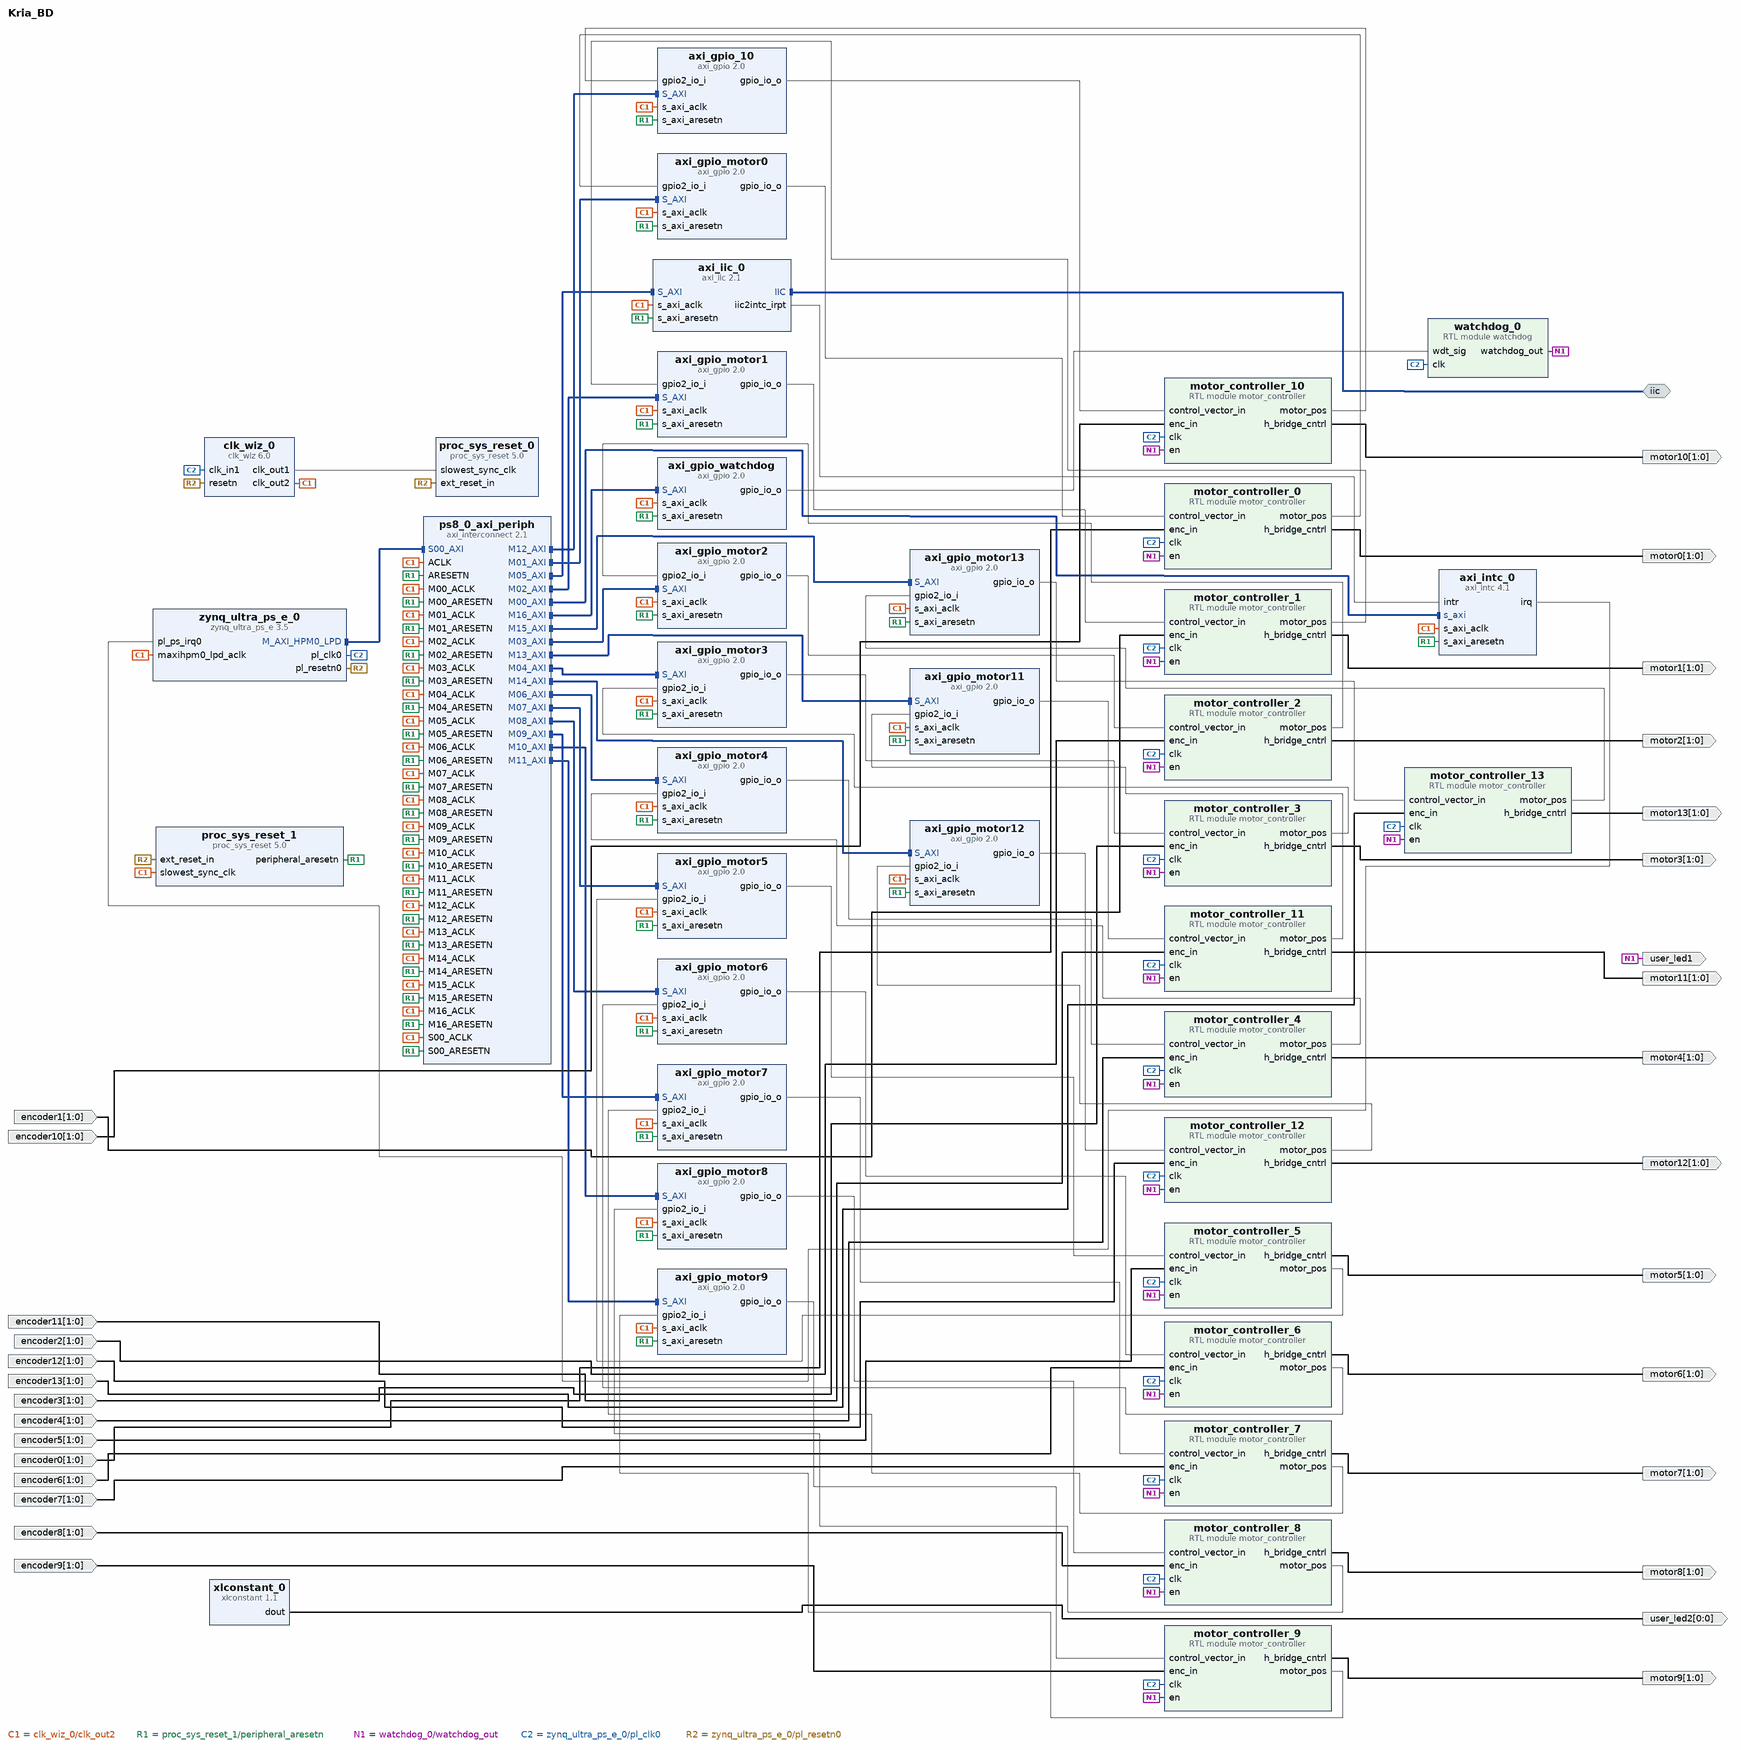
[diagram p0: block diagram of the top level]
# Vivado block design Kria_BD, xck26-sfvc784-2LV-c, Vivado 2023.1
create_bd_design Kria_BD

create_bd_intf_port -mode Master -vlnv xilinx.com:interface:iic_rtl:1.0 iic
create_bd_port -dir O -from 1 -to 0 motor0
create_bd_port -dir I -from 1 -to 0 encoder0
create_bd_port -dir I -from 1 -to 0 encoder1
create_bd_port -dir O -from 1 -to 0 motor1
create_bd_port -dir O -from 1 -to 0 motor2
create_bd_port -dir I -from 1 -to 0 encoder2
create_bd_port -dir O -from 1 -to 0 motor3
create_bd_port -dir I -from 1 -to 0 encoder3
create_bd_port -dir O -from 1 -to 0 motor4
create_bd_port -dir I -from 1 -to 0 encoder4
create_bd_port -dir O -from 1 -to 0 motor5
create_bd_port -dir I -from 1 -to 0 encoder5
create_bd_port -dir O -from 1 -to 0 motor6
create_bd_port -dir I -from 1 -to 0 encoder6
create_bd_port -dir I -from 1 -to 0 encoder7
create_bd_port -dir O -from 1 -to 0 motor7
create_bd_port -dir O -from 1 -to 0 motor8
create_bd_port -dir I -from 1 -to 0 encoder8
create_bd_port -dir O -from 1 -to 0 motor9
create_bd_port -dir I -from 1 -to 0 encoder9
create_bd_port -dir O -from 1 -to 0 motor10
create_bd_port -dir I -from 1 -to 0 encoder10
create_bd_port -dir O -from 1 -to 0 motor11
create_bd_port -dir I -from 1 -to 0 encoder11
create_bd_port -dir O -from 1 -to 0 motor12
create_bd_port -dir I -from 1 -to 0 encoder12
create_bd_port -dir O -from 1 -to 0 motor13
create_bd_port -dir I -from 1 -to 0 encoder13
create_bd_port -dir O user_led1
create_bd_port -dir O -from 0 -to 0 user_led2

create_bd_cell -type ip -vlnv xilinx.com:ip:zynq_ultra_ps_e:3.5 zynq_ultra_ps_e_0
set_property -dict [list \
  CONFIG.PSU_BANK_0_IO_STANDARD LVCMOS18 \
  CONFIG.PSU_BANK_1_IO_STANDARD LVCMOS18 \
  CONFIG.PSU_BANK_2_IO_STANDARD LVCMOS18 \
  CONFIG.PSU_BANK_3_IO_STANDARD LVCMOS18 \
  CONFIG.PSU__CRF_APB__ACPU_CTRL__FREQMHZ 1333.333 \
  CONFIG.PSU__CRF_APB__ACPU_CTRL__SRCSEL APLL \
  CONFIG.PSU__CRF_APB__APLL_CTRL__SRCSEL PSS_REF_CLK \
  CONFIG.PSU__CRF_APB__APLL_FRAC_CFG__ENABLED 1 \
  CONFIG.PSU__CRF_APB__DBG_FPD_CTRL__FREQMHZ 250 \
  CONFIG.PSU__CRF_APB__DBG_FPD_CTRL__SRCSEL IOPLL \
  CONFIG.PSU__CRF_APB__DBG_TRACE_CTRL__FREQMHZ 250 \
  CONFIG.PSU__CRF_APB__DBG_TRACE_CTRL__SRCSEL IOPLL \
  CONFIG.PSU__CRF_APB__DBG_TSTMP_CTRL__FREQMHZ 250 \
  CONFIG.PSU__CRF_APB__DBG_TSTMP_CTRL__SRCSEL IOPLL \
  CONFIG.PSU__CRF_APB__DDR_CTRL__FREQMHZ 1200 \
  CONFIG.PSU__CRF_APB__DDR_CTRL__SRCSEL DPLL \
  CONFIG.PSU__CRF_APB__DPDMA_REF_CTRL__FREQMHZ 600 \
  CONFIG.PSU__CRF_APB__DPDMA_REF_CTRL__SRCSEL APLL \
  CONFIG.PSU__CRF_APB__DPLL_CTRL__SRCSEL PSS_REF_CLK \
  CONFIG.PSU__CRF_APB__DP_AUDIO_REF_CTRL__SRCSEL RPLL \
  CONFIG.PSU__CRF_APB__DP_STC_REF_CTRL__SRCSEL RPLL \
  CONFIG.PSU__CRF_APB__DP_VIDEO_REF_CTRL__SRCSEL VPLL \
  CONFIG.PSU__CRF_APB__GDMA_REF_CTRL__FREQMHZ 600 \
  CONFIG.PSU__CRF_APB__GDMA_REF_CTRL__SRCSEL DPLL \
  CONFIG.PSU__CRF_APB__GPU_REF_CTRL__FREQMHZ 600 \
  CONFIG.PSU__CRF_APB__GPU_REF_CTRL__SRCSEL IOPLL \
  CONFIG.PSU__CRF_APB__TOPSW_LSBUS_CTRL__FREQMHZ 100 \
  CONFIG.PSU__CRF_APB__TOPSW_LSBUS_CTRL__SRCSEL IOPLL \
  CONFIG.PSU__CRF_APB__TOPSW_MAIN_CTRL__FREQMHZ 533.33 \
  CONFIG.PSU__CRF_APB__TOPSW_MAIN_CTRL__SRCSEL DPLL \
  CONFIG.PSU__CRF_APB__VPLL_CTRL__SRCSEL PSS_REF_CLK \
  CONFIG.PSU__CRL_APB__ADMA_REF_CTRL__FREQMHZ 500 \
  CONFIG.PSU__CRL_APB__ADMA_REF_CTRL__SRCSEL IOPLL \
  CONFIG.PSU__CRL_APB__CPU_R5_CTRL__FREQMHZ 533.333 \
  CONFIG.PSU__CRL_APB__CPU_R5_CTRL__SRCSEL RPLL \
  CONFIG.PSU__CRL_APB__DBG_LPD_CTRL__FREQMHZ 250 \
  CONFIG.PSU__CRL_APB__DBG_LPD_CTRL__SRCSEL IOPLL \
  CONFIG.PSU__CRL_APB__IOPLL_CTRL__SRCSEL PSS_REF_CLK \
  CONFIG.PSU__CRL_APB__IOU_SWITCH_CTRL__FREQMHZ 250 \
  CONFIG.PSU__CRL_APB__IOU_SWITCH_CTRL__SRCSEL IOPLL \
  CONFIG.PSU__CRL_APB__LPD_LSBUS_CTRL__FREQMHZ 100 \
  CONFIG.PSU__CRL_APB__LPD_LSBUS_CTRL__SRCSEL IOPLL \
  CONFIG.PSU__CRL_APB__LPD_SWITCH_CTRL__FREQMHZ 500 \
  CONFIG.PSU__CRL_APB__LPD_SWITCH_CTRL__SRCSEL IOPLL \
  CONFIG.PSU__CRL_APB__PCAP_CTRL__FREQMHZ 200 \
  CONFIG.PSU__CRL_APB__PCAP_CTRL__SRCSEL IOPLL \
  CONFIG.PSU__CRL_APB__PL0_REF_CTRL__FREQMHZ 100 \
  CONFIG.PSU__CRL_APB__PL0_REF_CTRL__SRCSEL IOPLL \
  CONFIG.PSU__CRL_APB__PL1_REF_CTRL__SRCSEL IOPLL \
  CONFIG.PSU__CRL_APB__QSPI_REF_CTRL__FREQMHZ 125 \
  CONFIG.PSU__CRL_APB__QSPI_REF_CTRL__SRCSEL IOPLL \
  CONFIG.PSU__CRL_APB__RPLL_CTRL__SRCSEL PSS_REF_CLK \
  CONFIG.PSU__CRL_APB__SPI1_REF_CTRL__SRCSEL IOPLL \
  CONFIG.PSU__CRL_APB__TIMESTAMP_REF_CTRL__FREQMHZ 100 \
  CONFIG.PSU__CRL_APB__TIMESTAMP_REF_CTRL__SRCSEL IOPLL \
  CONFIG.PSU__CSUPMU__PERIPHERAL__VALID 1 \
  CONFIG.PSU__DDRC__BUS_WIDTH {64 Bit} \
  CONFIG.PSU__DDRC__COMPONENTS Components \
  CONFIG.PSU__DDRC__DEVICE_CAPACITY {8192 MBits} \
  CONFIG.PSU__DDRC__DRAM_WIDTH {16 Bits} \
  CONFIG.PSU__DDRC__ECC Disabled \
  CONFIG.PSU__DDRC__MEMORY_TYPE {DDR 4} \
  CONFIG.PSU__DDRC__SPEED_BIN DDR4_2400R \
  CONFIG.PSU__DDR_HIGH_ADDRESS_GUI_ENABLE 1 \
  CONFIG.PSU__DDR__INTERFACE__FREQMHZ 600.000 \
  CONFIG.PSU__DISPLAYPORT__LANE0__ENABLE 0 \
  CONFIG.PSU__DISPLAYPORT__LANE1__ENABLE 0 \
  CONFIG.PSU__DISPLAYPORT__PERIPHERAL__ENABLE 1 \
  CONFIG.PSU__DPAUX__PERIPHERAL__ENABLE 1 \
  CONFIG.PSU__DPAUX__PERIPHERAL__IO {MIO 27 .. 30} \
  CONFIG.PSU__DP__LANE_SEL None \
  CONFIG.PSU__FPGA_PL0_ENABLE 1 \
  CONFIG.PSU__FPGA_PL1_ENABLE 1 \
  CONFIG.PSU__GPIO0_MIO__IO {MIO 0 .. 25} \
  CONFIG.PSU__GPIO0_MIO__PERIPHERAL__ENABLE 1 \
  CONFIG.PSU__GPIO1_MIO__IO {MIO 26 .. 51} \
  CONFIG.PSU__GPIO1_MIO__PERIPHERAL__ENABLE 1 \
  CONFIG.PSU__GT__LINK_SPEED HBR \
  CONFIG.PSU__GT__PRE_EMPH_LVL_4 0 \
  CONFIG.PSU__GT__VLT_SWNG_LVL_4 0 \
  CONFIG.PSU__IOU_SLCR__IOU_TTC_APB_CLK__TTC0_SEL APB \
  CONFIG.PSU__IOU_SLCR__IOU_TTC_APB_CLK__TTC1_SEL APB \
  CONFIG.PSU__IOU_SLCR__IOU_TTC_APB_CLK__TTC2_SEL APB \
  CONFIG.PSU__IOU_SLCR__IOU_TTC_APB_CLK__TTC3_SEL APB \
  CONFIG.PSU__OVERRIDE__BASIC_CLOCK 0 \
  CONFIG.PSU__PMU_COHERENCY 0 \
  CONFIG.PSU__PMU__AIBACK__ENABLE 0 \
  CONFIG.PSU__PMU__EMIO_GPI__ENABLE 0 \
  CONFIG.PSU__PMU__EMIO_GPO__ENABLE 0 \
  CONFIG.PSU__PMU__GPI0__ENABLE 1 \
  CONFIG.PSU__PMU__GPI0__IO {MIO 26} \
  CONFIG.PSU__PMU__GPI1__ENABLE 0 \
  CONFIG.PSU__PMU__GPI2__ENABLE 0 \
  CONFIG.PSU__PMU__GPI3__ENABLE 0 \
  CONFIG.PSU__PMU__GPI4__ENABLE 0 \
  CONFIG.PSU__PMU__GPI5__ENABLE 1 \
  CONFIG.PSU__PMU__GPI5__IO {MIO 31} \
  CONFIG.PSU__PMU__GPO0__ENABLE 0 \
  CONFIG.PSU__PMU__GPO1__ENABLE 0 \
  CONFIG.PSU__PMU__GPO2__ENABLE 0 \
  CONFIG.PSU__PMU__GPO3__ENABLE 1 \
  CONFIG.PSU__PMU__GPO3__IO {MIO 35} \
  CONFIG.PSU__PMU__GPO3__POLARITY low \
  CONFIG.PSU__PMU__GPO4__ENABLE 0 \
  CONFIG.PSU__PMU__GPO5__ENABLE 0 \
  CONFIG.PSU__PMU__PERIPHERAL__ENABLE 1 \
  CONFIG.PSU__PMU__PLERROR__ENABLE 0 \
  CONFIG.PSU__PRESET_APPLIED 1 \
  CONFIG.PSU__PSS_REF_CLK__FREQMHZ 33.333 \
  CONFIG.PSU__QSPI_COHERENCY 0 \
  CONFIG.PSU__QSPI_ROUTE_THROUGH_FPD 0 \
  CONFIG.PSU__QSPI__GRP_FBCLK__ENABLE 0 \
  CONFIG.PSU__QSPI__PERIPHERAL__DATA_MODE x4 \
  CONFIG.PSU__QSPI__PERIPHERAL__ENABLE 1 \
  CONFIG.PSU__QSPI__PERIPHERAL__IO {MIO 0 .. 5} \
  CONFIG.PSU__QSPI__PERIPHERAL__MODE Single \
  CONFIG.PSU__SPI1__GRP_SS0__IO {MIO 9} \
  CONFIG.PSU__SPI1__PERIPHERAL__ENABLE 1 \
  CONFIG.PSU__SPI1__PERIPHERAL__IO {MIO 6 .. 11} \
  CONFIG.PSU__SWDT0__CLOCK__ENABLE 0 \
  CONFIG.PSU__SWDT0__PERIPHERAL__ENABLE 1 \
  CONFIG.PSU__SWDT0__RESET__ENABLE 0 \
  CONFIG.PSU__SWDT1__CLOCK__ENABLE 0 \
  CONFIG.PSU__SWDT1__PERIPHERAL__ENABLE 1 \
  CONFIG.PSU__SWDT1__RESET__ENABLE 0 \
  CONFIG.PSU__TTC0__CLOCK__ENABLE 0 \
  CONFIG.PSU__TTC0__PERIPHERAL__ENABLE 1 \
  CONFIG.PSU__TTC0__WAVEOUT__ENABLE 0 \
  CONFIG.PSU__TTC1__CLOCK__ENABLE 0 \
  CONFIG.PSU__TTC1__PERIPHERAL__ENABLE 1 \
  CONFIG.PSU__TTC1__WAVEOUT__ENABLE 0 \
  CONFIG.PSU__TTC2__CLOCK__ENABLE 0 \
  CONFIG.PSU__TTC2__PERIPHERAL__ENABLE 1 \
  CONFIG.PSU__TTC2__WAVEOUT__ENABLE 0 \
  CONFIG.PSU__TTC3__CLOCK__ENABLE 0 \
  CONFIG.PSU__TTC3__PERIPHERAL__ENABLE 1 \
  CONFIG.PSU__TTC3__WAVEOUT__ENABLE 0 \
  CONFIG.PSU__USE__IRQ0 1 \
  CONFIG.PSU__USE__M_AXI_GP0 0 \
  CONFIG.PSU__USE__M_AXI_GP1 0 \
  CONFIG.PSU__USE__M_AXI_GP2 1 \
] [get_bd_cells zynq_ultra_ps_e_0]
# 259 more settings of zynq_ultra_ps_e_0 are not shown: defaults, MIO pin electricals, DDR timing, and values the tool derives
create_bd_cell -type ip -vlnv xilinx.com:ip:clk_wiz:6.0 clk_wiz_0
set_property -dict [list \
  CONFIG.CLKOUT2_JITTER 102.087 \
  CONFIG.CLKOUT2_PHASE_ERROR 87.181 \
  CONFIG.CLKOUT2_REQUESTED_OUT_FREQ 200.000 \
  CONFIG.CLKOUT2_USED true \
  CONFIG.MMCM_CLKOUT1_DIVIDE 6 \
  CONFIG.NUM_OUT_CLKS 2 \
  CONFIG.RESET_PORT resetn \
  CONFIG.RESET_TYPE ACTIVE_LOW \
  CONFIG.USE_RESET true \
] [get_bd_cells clk_wiz_0]
create_bd_cell -type ip -vlnv xilinx.com:ip:proc_sys_reset:5.0 proc_sys_reset_0
create_bd_cell -type ip -vlnv xilinx.com:ip:proc_sys_reset:5.0 proc_sys_reset_1
create_bd_cell -type ip -vlnv xilinx.com:ip:axi_intc:4.1 axi_intc_0
set_property -dict {CONFIG.C_IRQ_CONNECTION 1} [get_bd_cells axi_intc_0]
create_bd_cell -type ip -vlnv xilinx.com:ip:axi_interconnect:2.1 ps8_0_axi_periph
set_property -dict {CONFIG.NUM_MI 17} [get_bd_cells ps8_0_axi_periph]
create_bd_cell -type ip -vlnv xilinx.com:ip:axi_iic:2.1 axi_iic_0
create_bd_cell -type ip -vlnv xilinx.com:ip:axi_gpio:2.0 axi_gpio_motor0
set_property -dict [list \
  CONFIG.C_ALL_INPUTS_2 1 \
  CONFIG.C_ALL_OUTPUTS 1 \
  CONFIG.C_GPIO2_WIDTH 16 \
  CONFIG.C_GPIO_WIDTH 15 \
  CONFIG.C_IS_DUAL 1 \
] [get_bd_cells axi_gpio_motor0]
create_bd_cell -type ip -vlnv xilinx.com:ip:axi_gpio:2.0 axi_gpio_motor1
set_property -dict [list \
  CONFIG.C_ALL_INPUTS_2 1 \
  CONFIG.C_ALL_OUTPUTS 1 \
  CONFIG.C_GPIO2_WIDTH 16 \
  CONFIG.C_GPIO_WIDTH 15 \
  CONFIG.C_IS_DUAL 1 \
] [get_bd_cells axi_gpio_motor1]
create_bd_cell -type ip -vlnv xilinx.com:ip:axi_gpio:2.0 axi_gpio_motor2
set_property -dict [list \
  CONFIG.C_ALL_INPUTS_2 1 \
  CONFIG.C_ALL_OUTPUTS 1 \
  CONFIG.C_GPIO2_WIDTH 16 \
  CONFIG.C_GPIO_WIDTH 15 \
  CONFIG.C_IS_DUAL 1 \
] [get_bd_cells axi_gpio_motor2]
create_bd_cell -type ip -vlnv xilinx.com:ip:axi_gpio:2.0 axi_gpio_motor3
set_property -dict [list \
  CONFIG.C_ALL_INPUTS_2 1 \
  CONFIG.C_ALL_OUTPUTS 1 \
  CONFIG.C_GPIO2_WIDTH 16 \
  CONFIG.C_GPIO_WIDTH 15 \
  CONFIG.C_IS_DUAL 1 \
] [get_bd_cells axi_gpio_motor3]
create_bd_cell -type ip -vlnv xilinx.com:ip:axi_gpio:2.0 axi_gpio_motor4
set_property -dict [list \
  CONFIG.C_ALL_INPUTS_2 1 \
  CONFIG.C_ALL_OUTPUTS 1 \
  CONFIG.C_GPIO2_WIDTH 16 \
  CONFIG.C_GPIO_WIDTH 15 \
  CONFIG.C_IS_DUAL 1 \
] [get_bd_cells axi_gpio_motor4]
create_bd_cell -type ip -vlnv xilinx.com:ip:axi_gpio:2.0 axi_gpio_motor5
set_property -dict [list \
  CONFIG.C_ALL_INPUTS_2 1 \
  CONFIG.C_ALL_OUTPUTS 1 \
  CONFIG.C_GPIO2_WIDTH 16 \
  CONFIG.C_GPIO_WIDTH 15 \
  CONFIG.C_IS_DUAL 1 \
] [get_bd_cells axi_gpio_motor5]
create_bd_cell -type ip -vlnv xilinx.com:ip:axi_gpio:2.0 axi_gpio_motor6
set_property -dict [list \
  CONFIG.C_ALL_INPUTS_2 1 \
  CONFIG.C_ALL_OUTPUTS 1 \
  CONFIG.C_GPIO2_WIDTH 16 \
  CONFIG.C_GPIO_WIDTH 15 \
  CONFIG.C_IS_DUAL 1 \
] [get_bd_cells axi_gpio_motor6]
create_bd_cell -type ip -vlnv xilinx.com:ip:axi_gpio:2.0 axi_gpio_motor7
set_property -dict [list \
  CONFIG.C_ALL_INPUTS 0 \
  CONFIG.C_ALL_INPUTS_2 1 \
  CONFIG.C_ALL_OUTPUTS 1 \
  CONFIG.C_GPIO2_WIDTH 16 \
  CONFIG.C_GPIO_WIDTH 15 \
  CONFIG.C_IS_DUAL 1 \
] [get_bd_cells axi_gpio_motor7]
create_bd_cell -type ip -vlnv xilinx.com:ip:axi_gpio:2.0 axi_gpio_motor8
set_property -dict [list \
  CONFIG.C_ALL_INPUTS 0 \
  CONFIG.C_ALL_INPUTS_2 1 \
  CONFIG.C_ALL_OUTPUTS 1 \
  CONFIG.C_GPIO2_WIDTH 16 \
  CONFIG.C_GPIO_WIDTH 15 \
  CONFIG.C_IS_DUAL 1 \
] [get_bd_cells axi_gpio_motor8]
create_bd_cell -type ip -vlnv xilinx.com:ip:axi_gpio:2.0 axi_gpio_motor9
set_property -dict [list \
  CONFIG.C_ALL_INPUTS_2 1 \
  CONFIG.C_ALL_OUTPUTS 1 \
  CONFIG.C_GPIO2_WIDTH 16 \
  CONFIG.C_GPIO_WIDTH 15 \
  CONFIG.C_IS_DUAL 1 \
] [get_bd_cells axi_gpio_motor9]
create_bd_cell -type ip -vlnv xilinx.com:ip:axi_gpio:2.0 axi_gpio_10
set_property -dict [list \
  CONFIG.C_ALL_INPUTS 0 \
  CONFIG.C_ALL_INPUTS_2 1 \
  CONFIG.C_ALL_OUTPUTS 1 \
  CONFIG.C_GPIO2_WIDTH 16 \
  CONFIG.C_GPIO_WIDTH 15 \
  CONFIG.C_IS_DUAL 1 \
] [get_bd_cells axi_gpio_10]
create_bd_cell -type ip -vlnv xilinx.com:ip:axi_gpio:2.0 axi_gpio_motor11
set_property -dict [list \
  CONFIG.C_ALL_INPUTS_2 1 \
  CONFIG.C_ALL_OUTPUTS 1 \
  CONFIG.C_GPIO2_WIDTH 16 \
  CONFIG.C_GPIO_WIDTH 15 \
  CONFIG.C_IS_DUAL 1 \
] [get_bd_cells axi_gpio_motor11]
create_bd_cell -type ip -vlnv xilinx.com:ip:axi_gpio:2.0 axi_gpio_motor12
set_property -dict [list \
  CONFIG.C_ALL_INPUTS_2 1 \
  CONFIG.C_ALL_OUTPUTS 1 \
  CONFIG.C_GPIO2_WIDTH 16 \
  CONFIG.C_GPIO_WIDTH 15 \
  CONFIG.C_IS_DUAL 1 \
] [get_bd_cells axi_gpio_motor12]
create_bd_cell -type ip -vlnv xilinx.com:ip:axi_gpio:2.0 axi_gpio_motor13
set_property -dict [list \
  CONFIG.C_ALL_INPUTS_2 1 \
  CONFIG.C_ALL_OUTPUTS 1 \
  CONFIG.C_GPIO2_WIDTH 16 \
  CONFIG.C_GPIO_WIDTH 15 \
  CONFIG.C_IS_DUAL 1 \
] [get_bd_cells axi_gpio_motor13]
create_bd_cell -type ip -vlnv xilinx.com:ip:axi_gpio:2.0 axi_gpio_watchdog
set_property -dict {CONFIG.C_ALL_OUTPUTS 1 CONFIG.C_GPIO_WIDTH 1} [get_bd_cells axi_gpio_watchdog]
create_bd_cell -type module -reference motor_controller motor_controller_0
create_bd_cell -type module -reference motor_controller motor_controller_10
create_bd_cell -type module -reference motor_controller motor_controller_11
create_bd_cell -type module -reference motor_controller motor_controller_12
create_bd_cell -type module -reference motor_controller motor_controller_13
create_bd_cell -type module -reference motor_controller motor_controller_1
create_bd_cell -type module -reference motor_controller motor_controller_2
create_bd_cell -type module -reference motor_controller motor_controller_3
create_bd_cell -type module -reference motor_controller motor_controller_4
create_bd_cell -type module -reference motor_controller motor_controller_5
create_bd_cell -type module -reference motor_controller motor_controller_6
create_bd_cell -type module -reference motor_controller motor_controller_7
create_bd_cell -type module -reference motor_controller motor_controller_8
create_bd_cell -type module -reference motor_controller motor_controller_9
create_bd_cell -type module -reference watchdog watchdog_0
create_bd_cell -type ip -vlnv xilinx.com:ip:xlconstant:1.1 xlconstant_0

# ---- connections ----

connect_bd_intf_net [get_bd_intf_ports iic] [get_bd_intf_pins axi_iic_0/IIC]
connect_bd_intf_net [get_bd_intf_pins ps8_0_axi_periph/M00_AXI] [get_bd_intf_pins axi_intc_0/s_axi]
connect_bd_intf_net [get_bd_intf_pins ps8_0_axi_periph/M01_AXI] [get_bd_intf_pins axi_gpio_motor0/S_AXI]
connect_bd_intf_net [get_bd_intf_pins ps8_0_axi_periph/M02_AXI] [get_bd_intf_pins axi_gpio_motor1/S_AXI]
connect_bd_intf_net [get_bd_intf_pins ps8_0_axi_periph/M03_AXI] [get_bd_intf_pins axi_gpio_motor2/S_AXI]
connect_bd_intf_net [get_bd_intf_pins ps8_0_axi_periph/M04_AXI] [get_bd_intf_pins axi_gpio_motor3/S_AXI]
connect_bd_intf_net [get_bd_intf_pins ps8_0_axi_periph/M05_AXI] [get_bd_intf_pins axi_iic_0/S_AXI]
connect_bd_intf_net [get_bd_intf_pins ps8_0_axi_periph/M06_AXI] [get_bd_intf_pins axi_gpio_motor4/S_AXI]
connect_bd_intf_net [get_bd_intf_pins ps8_0_axi_periph/M07_AXI] [get_bd_intf_pins axi_gpio_motor5/S_AXI]
connect_bd_intf_net [get_bd_intf_pins ps8_0_axi_periph/M08_AXI] [get_bd_intf_pins axi_gpio_motor6/S_AXI]
connect_bd_intf_net [get_bd_intf_pins ps8_0_axi_periph/M09_AXI] [get_bd_intf_pins axi_gpio_motor7/S_AXI]
connect_bd_intf_net [get_bd_intf_pins ps8_0_axi_periph/M10_AXI] [get_bd_intf_pins axi_gpio_motor8/S_AXI]
connect_bd_intf_net [get_bd_intf_pins ps8_0_axi_periph/M11_AXI] [get_bd_intf_pins axi_gpio_motor9/S_AXI]
connect_bd_intf_net [get_bd_intf_pins ps8_0_axi_periph/M12_AXI] [get_bd_intf_pins axi_gpio_10/S_AXI]
connect_bd_intf_net [get_bd_intf_pins ps8_0_axi_periph/M13_AXI] [get_bd_intf_pins axi_gpio_motor11/S_AXI]
connect_bd_intf_net [get_bd_intf_pins ps8_0_axi_periph/M14_AXI] [get_bd_intf_pins axi_gpio_motor12/S_AXI]
connect_bd_intf_net [get_bd_intf_pins ps8_0_axi_periph/M15_AXI] [get_bd_intf_pins axi_gpio_motor13/S_AXI]
connect_bd_intf_net [get_bd_intf_pins ps8_0_axi_periph/M16_AXI] [get_bd_intf_pins axi_gpio_watchdog/S_AXI]
connect_bd_intf_net [get_bd_intf_pins zynq_ultra_ps_e_0/M_AXI_HPM0_LPD] [get_bd_intf_pins ps8_0_axi_periph/S00_AXI]
connect_bd_net -net axi_gpio_0_gpio_io_o [get_bd_pins axi_gpio_motor0/gpio_io_o] [get_bd_pins motor_controller_0/control_vector_in]
connect_bd_net [get_bd_pins axi_gpio_10/gpio_io_o] [get_bd_pins motor_controller_10/control_vector_in]
connect_bd_net -net axi_gpio_11_gpio_io_o [get_bd_pins axi_gpio_motor11/gpio_io_o] [get_bd_pins motor_controller_11/control_vector_in]
connect_bd_net -net axi_gpio_12_gpio_io_o [get_bd_pins axi_gpio_motor12/gpio_io_o] [get_bd_pins motor_controller_12/control_vector_in]
connect_bd_net -net axi_gpio_13_gpio_io_o [get_bd_pins axi_gpio_motor13/gpio_io_o] [get_bd_pins motor_controller_13/control_vector_in]
connect_bd_net -net axi_gpio_1_gpio_io_o [get_bd_pins axi_gpio_motor1/gpio_io_o] [get_bd_pins motor_controller_1/control_vector_in]
connect_bd_net -net axi_gpio_2_gpio_io_o [get_bd_pins axi_gpio_motor2/gpio_io_o] [get_bd_pins motor_controller_2/control_vector_in]
connect_bd_net -net axi_gpio_3_gpio_io_o [get_bd_pins axi_gpio_motor3/gpio_io_o] [get_bd_pins motor_controller_3/control_vector_in]
connect_bd_net -net axi_gpio_4_gpio_io_o [get_bd_pins axi_gpio_motor4/gpio_io_o] [get_bd_pins motor_controller_4/control_vector_in]
connect_bd_net -net axi_gpio_5_gpio_io_o [get_bd_pins axi_gpio_motor5/gpio_io_o] [get_bd_pins motor_controller_5/control_vector_in]
connect_bd_net -net axi_gpio_6_gpio_io_o [get_bd_pins axi_gpio_motor6/gpio_io_o] [get_bd_pins motor_controller_6/control_vector_in]
connect_bd_net -net axi_gpio_7_gpio_io_o [get_bd_pins axi_gpio_motor7/gpio_io_o] [get_bd_pins motor_controller_7/control_vector_in]
connect_bd_net -net axi_gpio_8_gpio_io_o [get_bd_pins axi_gpio_motor8/gpio_io_o] [get_bd_pins motor_controller_8/control_vector_in]
connect_bd_net -net axi_gpio_9_gpio_io_o [get_bd_pins axi_gpio_motor9/gpio_io_o] [get_bd_pins motor_controller_9/control_vector_in]
connect_bd_net [get_bd_pins axi_iic_0/iic2intc_irpt] [get_bd_pins axi_intc_0/intr]
connect_bd_net [get_bd_pins axi_intc_0/irq] [get_bd_pins zynq_ultra_ps_e_0/pl_ps_irq0]
connect_bd_net [get_bd_pins clk_wiz_0/clk_out1] [get_bd_pins proc_sys_reset_0/slowest_sync_clk]
connect_bd_net [get_bd_pins clk_wiz_0/clk_out2] \
  [get_bd_pins proc_sys_reset_1/slowest_sync_clk] [get_bd_pins ps8_0_axi_periph/ACLK] \
  [get_bd_pins zynq_ultra_ps_e_0/maxihpm0_lpd_aclk] [get_bd_pins ps8_0_axi_periph/S00_ACLK] \
  [get_bd_pins axi_intc_0/s_axi_aclk] [get_bd_pins ps8_0_axi_periph/M00_ACLK] [get_bd_pins ps8_0_axi_periph/M01_ACLK] \
  [get_bd_pins ps8_0_axi_periph/M02_ACLK] [get_bd_pins ps8_0_axi_periph/M03_ACLK] [get_bd_pins ps8_0_axi_periph/M04_ACLK] \
  [get_bd_pins axi_iic_0/s_axi_aclk] [get_bd_pins ps8_0_axi_periph/M05_ACLK] [get_bd_pins axi_gpio_motor0/s_axi_aclk] \
  [get_bd_pins axi_gpio_motor1/s_axi_aclk] [get_bd_pins axi_gpio_motor2/s_axi_aclk] [get_bd_pins axi_gpio_motor3/s_axi_aclk] \
  [get_bd_pins axi_gpio_motor4/s_axi_aclk] [get_bd_pins ps8_0_axi_periph/M06_ACLK] [get_bd_pins axi_gpio_motor5/s_axi_aclk] \
  [get_bd_pins ps8_0_axi_periph/M07_ACLK] [get_bd_pins axi_gpio_motor6/s_axi_aclk] [get_bd_pins ps8_0_axi_periph/M08_ACLK] \
  [get_bd_pins axi_gpio_motor7/s_axi_aclk] [get_bd_pins ps8_0_axi_periph/M09_ACLK] [get_bd_pins axi_gpio_motor8/s_axi_aclk] \
  [get_bd_pins ps8_0_axi_periph/M10_ACLK] [get_bd_pins axi_gpio_motor9/s_axi_aclk] [get_bd_pins ps8_0_axi_periph/M11_ACLK] \
  [get_bd_pins axi_gpio_10/s_axi_aclk] [get_bd_pins ps8_0_axi_periph/M12_ACLK] [get_bd_pins axi_gpio_motor11/s_axi_aclk] \
  [get_bd_pins ps8_0_axi_periph/M13_ACLK] [get_bd_pins axi_gpio_motor12/s_axi_aclk] [get_bd_pins ps8_0_axi_periph/M14_ACLK] \
  [get_bd_pins axi_gpio_motor13/s_axi_aclk] [get_bd_pins ps8_0_axi_periph/M15_ACLK] \
  [get_bd_pins axi_gpio_watchdog/s_axi_aclk] [get_bd_pins ps8_0_axi_periph/M16_ACLK]
connect_bd_net -net enc_in_0_1 [get_bd_ports encoder1] [get_bd_pins motor_controller_1/enc_in]
connect_bd_net -net enc_in_10_1 [get_bd_ports encoder11] [get_bd_pins motor_controller_11/enc_in]
connect_bd_net -net enc_in_11_1 [get_bd_ports encoder12] [get_bd_pins motor_controller_12/enc_in]
connect_bd_net -net enc_in_12_1 [get_bd_ports encoder13] [get_bd_pins motor_controller_13/enc_in]
connect_bd_net -net enc_in_1_1 [get_bd_ports encoder2] [get_bd_pins motor_controller_2/enc_in]
connect_bd_net -net enc_in_2_1 [get_bd_ports encoder3] [get_bd_pins motor_controller_3/enc_in]
connect_bd_net -net enc_in_3_1 [get_bd_ports encoder4] [get_bd_pins motor_controller_4/enc_in]
connect_bd_net -net enc_in_4_1 [get_bd_ports encoder5] [get_bd_pins motor_controller_5/enc_in]
connect_bd_net -net enc_in_5_1 [get_bd_ports encoder6] [get_bd_pins motor_controller_6/enc_in]
connect_bd_net -net enc_in_6_1 [get_bd_ports encoder7] [get_bd_pins motor_controller_7/enc_in]
connect_bd_net -net enc_in_7_1 [get_bd_ports encoder8] [get_bd_pins motor_controller_8/enc_in]
connect_bd_net -net enc_in_8_1 [get_bd_ports encoder9] [get_bd_pins motor_controller_9/enc_in]
connect_bd_net -net enc_in_9_1 [get_bd_ports encoder10] [get_bd_pins motor_controller_10/enc_in]
connect_bd_net [get_bd_pins motor_controller_0/h_bridge_cntrl] [get_bd_ports motor0]
connect_bd_net [get_bd_pins motor_controller_0/motor_pos] [get_bd_pins axi_gpio_motor0/gpio2_io_i]
connect_bd_net [get_bd_pins motor_controller_10/h_bridge_cntrl] [get_bd_ports motor10]
connect_bd_net [get_bd_pins motor_controller_10/motor_pos] [get_bd_pins axi_gpio_10/gpio2_io_i]
connect_bd_net [get_bd_pins motor_controller_11/h_bridge_cntrl] [get_bd_ports motor11]
connect_bd_net [get_bd_pins motor_controller_11/motor_pos] [get_bd_pins axi_gpio_motor11/gpio2_io_i]
connect_bd_net [get_bd_pins motor_controller_12/h_bridge_cntrl] [get_bd_ports motor12]
connect_bd_net [get_bd_pins motor_controller_12/motor_pos] [get_bd_pins axi_gpio_motor12/gpio2_io_i]
connect_bd_net [get_bd_pins motor_controller_13/h_bridge_cntrl] [get_bd_ports motor13]
connect_bd_net [get_bd_pins motor_controller_13/motor_pos] [get_bd_pins axi_gpio_motor13/gpio2_io_i]
connect_bd_net [get_bd_pins motor_controller_1/h_bridge_cntrl] [get_bd_ports motor1]
connect_bd_net [get_bd_pins motor_controller_1/motor_pos] [get_bd_pins axi_gpio_motor1/gpio2_io_i]
connect_bd_net [get_bd_pins motor_controller_2/h_bridge_cntrl] [get_bd_ports motor2]
connect_bd_net [get_bd_pins motor_controller_2/motor_pos] [get_bd_pins axi_gpio_motor2/gpio2_io_i]
connect_bd_net [get_bd_pins motor_controller_3/h_bridge_cntrl] [get_bd_ports motor3]
connect_bd_net [get_bd_pins motor_controller_3/motor_pos] [get_bd_pins axi_gpio_motor3/gpio2_io_i]
connect_bd_net [get_bd_pins motor_controller_4/h_bridge_cntrl] [get_bd_ports motor4]
connect_bd_net [get_bd_pins motor_controller_4/motor_pos] [get_bd_pins axi_gpio_motor4/gpio2_io_i]
connect_bd_net [get_bd_pins motor_controller_5/h_bridge_cntrl] [get_bd_ports motor5]
connect_bd_net [get_bd_pins motor_controller_5/motor_pos] [get_bd_pins axi_gpio_motor5/gpio2_io_i]
connect_bd_net [get_bd_pins motor_controller_6/h_bridge_cntrl] [get_bd_ports motor6]
connect_bd_net [get_bd_pins motor_controller_6/motor_pos] [get_bd_pins axi_gpio_motor6/gpio2_io_i]
connect_bd_net [get_bd_pins motor_controller_7/h_bridge_cntrl] [get_bd_ports motor7]
connect_bd_net [get_bd_pins motor_controller_7/motor_pos] [get_bd_pins axi_gpio_motor7/gpio2_io_i]
connect_bd_net [get_bd_pins motor_controller_8/h_bridge_cntrl] [get_bd_ports motor8]
connect_bd_net [get_bd_pins motor_controller_8/motor_pos] [get_bd_pins axi_gpio_motor8/gpio2_io_i]
connect_bd_net [get_bd_pins motor_controller_9/h_bridge_cntrl] [get_bd_ports motor9]
connect_bd_net [get_bd_pins motor_controller_9/motor_pos] [get_bd_pins axi_gpio_motor9/gpio2_io_i]
connect_bd_net -net pmod2_io_1 [get_bd_ports encoder0] [get_bd_pins motor_controller_0/enc_in]
connect_bd_net [get_bd_pins proc_sys_reset_1/peripheral_aresetn] \
  [get_bd_pins ps8_0_axi_periph/S00_ARESETN] [get_bd_pins axi_intc_0/s_axi_aresetn] \
  [get_bd_pins ps8_0_axi_periph/M00_ARESETN] [get_bd_pins ps8_0_axi_periph/ARESETN] \
  [get_bd_pins ps8_0_axi_periph/M01_ARESETN] [get_bd_pins ps8_0_axi_periph/M02_ARESETN] \
  [get_bd_pins ps8_0_axi_periph/M03_ARESETN] [get_bd_pins ps8_0_axi_periph/M04_ARESETN] [get_bd_pins axi_iic_0/s_axi_aresetn] \
  [get_bd_pins ps8_0_axi_periph/M05_ARESETN] [get_bd_pins axi_gpio_motor0/s_axi_aresetn] \
  [get_bd_pins axi_gpio_motor1/s_axi_aresetn] [get_bd_pins axi_gpio_motor2/s_axi_aresetn] \
  [get_bd_pins axi_gpio_motor3/s_axi_aresetn] [get_bd_pins axi_gpio_motor4/s_axi_aresetn] \
  [get_bd_pins ps8_0_axi_periph/M06_ARESETN] [get_bd_pins axi_gpio_motor5/s_axi_aresetn] \
  [get_bd_pins ps8_0_axi_periph/M07_ARESETN] [get_bd_pins axi_gpio_motor6/s_axi_aresetn] \
  [get_bd_pins ps8_0_axi_periph/M08_ARESETN] [get_bd_pins axi_gpio_motor7/s_axi_aresetn] \
  [get_bd_pins ps8_0_axi_periph/M09_ARESETN] [get_bd_pins axi_gpio_motor8/s_axi_aresetn] \
  [get_bd_pins ps8_0_axi_periph/M10_ARESETN] [get_bd_pins axi_gpio_motor9/s_axi_aresetn] \
  [get_bd_pins ps8_0_axi_periph/M11_ARESETN] [get_bd_pins axi_gpio_10/s_axi_aresetn] \
  [get_bd_pins ps8_0_axi_periph/M12_ARESETN] [get_bd_pins axi_gpio_motor11/s_axi_aresetn] \
  [get_bd_pins ps8_0_axi_periph/M13_ARESETN] [get_bd_pins axi_gpio_motor12/s_axi_aresetn] \
  [get_bd_pins ps8_0_axi_periph/M14_ARESETN] [get_bd_pins axi_gpio_motor13/s_axi_aresetn] \
  [get_bd_pins ps8_0_axi_periph/M15_ARESETN] [get_bd_pins axi_gpio_watchdog/s_axi_aresetn] \
  [get_bd_pins ps8_0_axi_periph/M16_ARESETN]
connect_bd_net -net watchdog_0_out [get_bd_pins watchdog_0/watchdog_out] \
  [get_bd_pins motor_controller_13/en] [get_bd_pins motor_controller_12/en] [get_bd_pins motor_controller_11/en] \
  [get_bd_pins motor_controller_10/en] [get_bd_pins motor_controller_9/en] [get_bd_pins motor_controller_8/en] \
  [get_bd_pins motor_controller_2/en] [get_bd_pins motor_controller_7/en] [get_bd_pins motor_controller_6/en] \
  [get_bd_pins motor_controller_5/en] [get_bd_pins motor_controller_4/en] [get_bd_pins motor_controller_3/en] \
  [get_bd_pins motor_controller_1/en] [get_bd_pins motor_controller_0/en] [get_bd_ports user_led1]
connect_bd_net -net watchdog_gpio_gpio_io_o [get_bd_pins axi_gpio_watchdog/gpio_io_o] [get_bd_pins watchdog_0/wdt_sig]
connect_bd_net [get_bd_pins xlconstant_0/dout] [get_bd_ports user_led2]
connect_bd_net [get_bd_pins zynq_ultra_ps_e_0/pl_clk0] \
  [get_bd_pins clk_wiz_0/clk_in1] [get_bd_pins motor_controller_0/clk] [get_bd_pins motor_controller_10/clk] \
  [get_bd_pins motor_controller_11/clk] [get_bd_pins motor_controller_12/clk] [get_bd_pins motor_controller_13/clk] \
  [get_bd_pins motor_controller_1/clk] [get_bd_pins motor_controller_2/clk] [get_bd_pins motor_controller_3/clk] \
  [get_bd_pins motor_controller_4/clk] [get_bd_pins motor_controller_5/clk] [get_bd_pins motor_controller_6/clk] \
  [get_bd_pins motor_controller_7/clk] [get_bd_pins motor_controller_8/clk] [get_bd_pins motor_controller_9/clk] \
  [get_bd_pins watchdog_0/clk]
connect_bd_net [get_bd_pins zynq_ultra_ps_e_0/pl_resetn0] \
  [get_bd_pins clk_wiz_0/resetn] [get_bd_pins proc_sys_reset_0/ext_reset_in] [get_bd_pins proc_sys_reset_1/ext_reset_in]
set_property PFM.AXI_PORT {M_AXI_HPM0_FPD {memport "M_AXI_GP" sptag "" memory "" is_range "false"} M_AXI_HPM1_FPD {memport "M_AXI_GP" sptag "" memory "" is_range "false"} S_AXI_HPC0_FPD {memport "S_AXI_HPC" sptag "" memory "" is_range "false"} S_AXI_HPC1_FPD {memport "S_AXI_HPC" sptag "" memory "" is_range "false"} S_AXI_HP0_FPD {memport "S_AXI_HP" sptag "" memory "" is_range "false"} S_AXI_HP1_FPD {memport "S_AXI_HP" sptag "" memory "" is_range "false"} S_AXI_HP2_FPD {memport "S_AXI_HP" sptag "" memory "" is_range "false"} S_AXI_HP3_FPD {memport "S_AXI_HP" sptag "" memory "" is_range "false"}} [get_bd_cells zynq_ultra_ps_e_0]
set_property PFM.CLOCK {clk_out1 {id "3" is_default "false" proc_sys_reset "/proc_sys_reset_0" status "fixed" freq_hz "100000000"} clk_out2 {id "4" is_default "true" proc_sys_reset "/proc_sys_reset_1" status "fixed" freq_hz "200000000"}} [get_bd_cells clk_wiz_0]

# ---- address map ----
assign_bd_address -offset 0x0080000000 -range 64K -target_address_space [get_bd_addr_spaces zynq_ultra_ps_e_0/Data] [get_bd_addr_segs axi_gpio_motor0/S_AXI/Reg]
assign_bd_address -offset 0x0080010000 -range 64K -target_address_space [get_bd_addr_spaces zynq_ultra_ps_e_0/Data] [get_bd_addr_segs axi_gpio_motor1/S_AXI/Reg]
assign_bd_address -offset 0x0080020000 -range 64K -target_address_space [get_bd_addr_spaces zynq_ultra_ps_e_0/Data] [get_bd_addr_segs axi_gpio_motor2/S_AXI/Reg]
assign_bd_address -offset 0x0080030000 -range 64K -target_address_space [get_bd_addr_spaces zynq_ultra_ps_e_0/Data] [get_bd_addr_segs axi_gpio_motor3/S_AXI/Reg]
assign_bd_address -offset 0x0080040000 -range 64K -target_address_space [get_bd_addr_spaces zynq_ultra_ps_e_0/Data] [get_bd_addr_segs axi_gpio_motor4/S_AXI/Reg]
assign_bd_address -offset 0x0080050000 -range 64K -target_address_space [get_bd_addr_spaces zynq_ultra_ps_e_0/Data] [get_bd_addr_segs axi_gpio_motor5/S_AXI/Reg]
assign_bd_address -offset 0x0080060000 -range 64K -target_address_space [get_bd_addr_spaces zynq_ultra_ps_e_0/Data] [get_bd_addr_segs axi_gpio_motor6/S_AXI/Reg]
assign_bd_address -offset 0x0080070000 -range 64K -target_address_space [get_bd_addr_spaces zynq_ultra_ps_e_0/Data] [get_bd_addr_segs axi_gpio_motor7/S_AXI/Reg]
assign_bd_address -offset 0x0080080000 -range 64K -target_address_space [get_bd_addr_spaces zynq_ultra_ps_e_0/Data] [get_bd_addr_segs axi_gpio_motor8/S_AXI/Reg]
assign_bd_address -offset 0x0080090000 -range 64K -target_address_space [get_bd_addr_spaces zynq_ultra_ps_e_0/Data] [get_bd_addr_segs axi_gpio_motor9/S_AXI/Reg]
assign_bd_address -offset 0x00800A0000 -range 64K -target_address_space [get_bd_addr_spaces zynq_ultra_ps_e_0/Data] [get_bd_addr_segs axi_gpio_10/S_AXI/Reg]
assign_bd_address -offset 0x00800B0000 -range 64K -target_address_space [get_bd_addr_spaces zynq_ultra_ps_e_0/Data] [get_bd_addr_segs axi_gpio_motor11/S_AXI/Reg]
assign_bd_address -offset 0x00800C0000 -range 64K -target_address_space [get_bd_addr_spaces zynq_ultra_ps_e_0/Data] [get_bd_addr_segs axi_gpio_motor12/S_AXI/Reg]
assign_bd_address -offset 0x00800D0000 -range 64K -target_address_space [get_bd_addr_spaces zynq_ultra_ps_e_0/Data] [get_bd_addr_segs axi_gpio_motor13/S_AXI/Reg]
assign_bd_address -offset 0x00800E0000 -range 64K -target_address_space [get_bd_addr_spaces zynq_ultra_ps_e_0/Data] [get_bd_addr_segs axi_iic_0/S_AXI/Reg]
assign_bd_address -offset 0x00800F0000 -range 64K -target_address_space [get_bd_addr_spaces zynq_ultra_ps_e_0/Data] [get_bd_addr_segs axi_intc_0/S_AXI/Reg]
assign_bd_address -offset 0x0080100000 -range 64K -target_address_space [get_bd_addr_spaces zynq_ultra_ps_e_0/Data] [get_bd_addr_segs axi_gpio_watchdog/S_AXI/Reg]

validate_bd_design
save_bd_design
